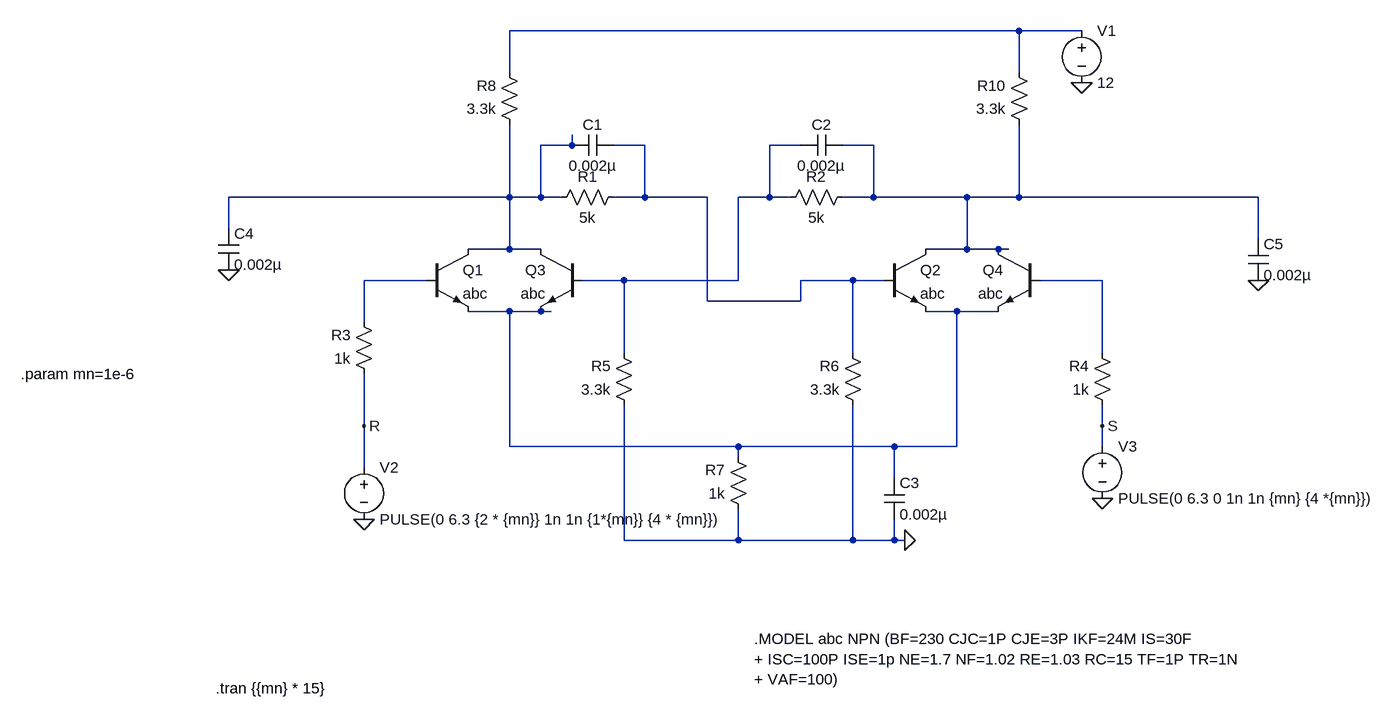
[diagram p0: schematic Draft5.asc]
Draft5.asc, the LTspice schematic file:
Version 4
SHEET 1 1348 680
WIRE 720 -512 -64 -512
WIRE 816 -512 720 -512
WIRE -64 -448 -64 -512
WIRE 720 -448 720 -512
WIRE 32 -336 32 -352
WIRE 32 -336 -16 -336
WIRE 144 -336 96 -336
WIRE 384 -336 336 -336
WIRE 496 -336 448 -336
WIRE -64 -256 -64 -368
WIRE -64 -256 -496 -256
WIRE -16 -256 -16 -336
WIRE -16 -256 -64 -256
WIRE 16 -256 -16 -256
WIRE 144 -256 144 -336
WIRE 144 -256 96 -256
WIRE 240 -256 144 -256
WIRE 336 -256 336 -336
WIRE 336 -256 288 -256
WIRE 368 -256 336 -256
WIRE 496 -256 496 -336
WIRE 496 -256 448 -256
WIRE 640 -256 496 -256
WIRE 720 -256 720 -368
WIRE 720 -256 640 -256
WIRE 1088 -256 720 -256
WIRE -496 -208 -496 -256
WIRE 1088 -192 1088 -256
WIRE -64 -176 -64 -256
WIRE -64 -176 -128 -176
WIRE -16 -176 -64 -176
WIRE 640 -176 640 -256
WIRE 640 -176 576 -176
WIRE 688 -176 640 -176
WIRE 704 -176 688 -176
WIRE -192 -128 -288 -128
WIRE 112 -128 48 -128
WIRE 288 -128 288 -256
WIRE 288 -128 112 -128
WIRE 464 -128 384 -128
WIRE 512 -128 464 -128
WIRE 848 -128 752 -128
WIRE 240 -96 240 -256
WIRE 384 -96 384 -128
WIRE 384 -96 240 -96
WIRE -64 -80 -128 -80
WIRE -16 -80 -64 -80
WIRE 0 -80 -16 -80
WIRE 624 -80 576 -80
WIRE 688 -80 624 -80
WIRE -288 -64 -288 -128
WIRE 112 -16 112 -128
WIRE 464 -16 464 -128
WIRE 848 -16 848 -128
WIRE -288 96 -288 16
WIRE 848 96 848 64
WIRE -64 128 -64 -80
WIRE 288 128 -64 128
WIRE 528 128 288 128
WIRE 624 128 624 -80
WIRE 624 128 528 128
WIRE 848 128 848 96
WIRE 288 144 288 128
WIRE -288 160 -288 96
WIRE 528 176 528 128
WIRE 112 272 112 64
WIRE 288 272 288 224
WIRE 288 272 112 272
WIRE 464 272 464 64
WIRE 464 272 288 272
WIRE 528 272 528 240
WIRE 528 272 464 272
WIRE 544 272 528 272
FLAG 544 272 0
FLAG 848 208 0
FLAG -288 240 0
FLAG 1088 -128 0
FLAG 816 -432 0
FLAG -496 -144 0
FLAG -288 96 R
FLAG 848 96 S
SYMBOL npn -192 -176 R0
SYMATTR InstName Q1
SYMATTR Value abc
SYMBOL npn 512 -176 R0
SYMATTR InstName Q2
SYMATTR Value abc
SYMBOL npn 48 -176 M0
SYMATTR InstName Q3
SYMATTR Value abc
SYMBOL npn 752 -176 M0
SYMATTR InstName Q4
SYMATTR Value abc
SYMBOL res 112 -272 R90
WINDOW 0 0 56 VBottom 2
WINDOW 3 32 56 VTop 2
SYMATTR InstName R1
SYMATTR Value 5k
SYMBOL res 464 -272 R90
WINDOW 0 0 56 VBottom 2
WINDOW 3 32 56 VTop 2
SYMATTR InstName R2
SYMATTR Value 5k
SYMBOL res -272 32 R180
WINDOW 0 36 76 Left 2
WINDOW 3 36 40 Left 2
SYMATTR InstName R3
SYMATTR Value 1k
SYMBOL res 864 80 R180
WINDOW 0 36 76 Left 2
WINDOW 3 36 40 Left 2
SYMATTR InstName R4
SYMATTR Value 1k
SYMBOL res 128 80 R180
WINDOW 0 36 76 Left 2
WINDOW 3 36 40 Left 2
SYMATTR InstName R5
SYMATTR Value 3.3k
SYMBOL res 480 80 R180
WINDOW 0 36 76 Left 2
WINDOW 3 36 40 Left 2
SYMATTR InstName R6
SYMATTR Value 3.3k
SYMBOL res 304 240 R180
WINDOW 0 36 76 Left 2
WINDOW 3 36 40 Left 2
SYMATTR InstName R7
SYMATTR Value 1k
SYMBOL res -48 -352 R180
WINDOW 0 36 76 Left 2
WINDOW 3 36 40 Left 2
SYMATTR InstName R8
SYMATTR Value 3.3k
SYMBOL res 736 -352 R180
WINDOW 0 36 76 Left 2
WINDOW 3 36 40 Left 2
SYMATTR InstName R10
SYMATTR Value 3.3k
SYMBOL cap 96 -352 R90
WINDOW 0 0 32 VBottom 2
WINDOW 3 32 32 VTop 2
SYMATTR InstName C1
SYMATTR Value 0.002µ
SYMBOL cap 448 -352 R90
WINDOW 0 0 32 VBottom 2
WINDOW 3 32 32 VTop 2
SYMATTR InstName C2
SYMATTR Value 0.002µ
SYMBOL cap 512 176 R0
SYMATTR InstName C3
SYMATTR Value 0.002µ
SYMBOL cap -512 -208 R0
SYMATTR InstName C4
SYMATTR Value 0.002µ
SYMBOL cap 1072 -192 R0
SYMATTR InstName C5
SYMATTR Value 0.002µ
SYMBOL voltage 816 -528 R0
WINDOW 123 0 0 Left 0
WINDOW 39 0 0 Left 0
SYMATTR InstName V1
SYMATTR Value 12
SYMBOL voltage -288 144 R0
WINDOW 123 0 0 Left 0
WINDOW 39 0 0 Left 0
SYMATTR InstName V2
SYMATTR Value PULSE(0 6.3 {2 * {mn}} 1n 1n {1*{mn}} {4 * {mn}})
SYMBOL voltage 848 112 R0
WINDOW 123 0 0 Left 0
WINDOW 39 0 0 Left 0
SYMATTR InstName V3
SYMATTR Value PULSE(0 6.3 0 1n 1n {mn} {4 *{mn}})
TEXT 312 424 Left 2 !.MODEL abc NPN (BF=230 CJC=1P CJE=3P IKF=24M IS=30F\n+ ISC=100P ISE=1p NE=1.7 NF=1.02 RE=1.03 RC=15 TF=1P TR=1N\n+ VAF=100)
TEXT -516 500 Left 2 !.tran {{mn} * 15}
TEXT -816 16 Left 2 !.param mn=1e-6

The netlist it stands for:
* Draft5.asc
Q1 N002 N006 N008 0 abc
Q2 N005 N003 N008 0 abc
Q3 N002 N004 N008 0 abc
Q4 N005 N007 N008 0 abc
R1 N003 N002 5k
R2 N005 N004 5k
R3 R N006 1k
R4 S N007 1k
R5 0 N004 3.3k
R6 0 N003 3.3k
R7 0 N008 1k
R8 N002 N001 3.3k
R10 N005 N001 3.3k
C1 N003 N002 0.002µ
C2 N005 N004 0.002µ
C3 N008 0 0.002µ
C4 N002 0 0.002µ
C5 N005 0 0.002µ
V1 N001 0 12
V2 R 0 PULSE(0 6.3 {2 * {mn}} 1n 1n {1*{mn}} {4 * {mn}})
V3 S 0 PULSE(0 6.3 0 1n 1n {mn} {4 *{mn}})
.model NPN NPN
.model PNP PNP
.lib standard.bjt
.MODEL abc NPN (BF=230 CJC=1P CJE=3P IKF=24M IS=30F
+ ISC=100P ISE=1p NE=1.7 NF=1.02 RE=1.03 RC=15 TF=1P TR=1N
+ VAF=100)
.tran {{mn} * 15}
.param mn=1e-6
.backanno
.end